# EAGLE schematic schema1 (EAGLE 6.2)
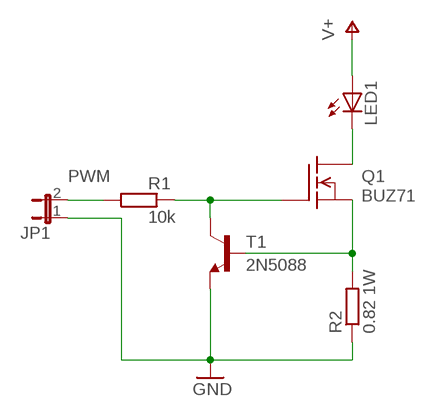
[diagram p0: schematic, sheet 1]

## Parts
JP1  JUMPER-2PTH  [1X02]
LED1  LED5MM  [LED5MM]
Q1  BUZ71  [TO220]
R1  10k  R-EU_0411/15  [0411/15]
R2  0.82 1W  R-EU_0411/15  [0411/15]
T1  2N5088  [TO92]

## Nets
GND: JP1.1 R2.1 T1.3(E)
N$2: LED1.K(C) Q1.2(D)
N$3: Q1.3(S) R2.2 T1.2(B)
N$5: Q1.1(G) R1.2 T1.1(C)
PWM: JP1.2 R1.1
V+: LED1.A

## Library data of the parts
JP1 = SparkFun:JUMPER-2: Jumper Basic 0.1" spaced jumper. Use with breakaway headers.
LED1 = SparkFun:LED: LEDs Standard schematic elements and footprints for 5mm, 3mm, 1206, and 0603 sized LEDs. 5mm - Spark Fun Electronics SKU : COM-00529 (and others)
Q1 = transistor-fet:BUZ71: N-Channel Enhancement MOSFET 50V; 14A; 0,1Ohm
R1 R2 = rcl:R-EU_: RESISTOR, European symbol
T1 = transistor:2N5088: NPN TRANSISTOR